# EAGLE design El_Würfel (EAGLE 7.7.0)
ABTEILUNG: Technische Informatik; BEARBEITER: Andrej Tica; DOKUMENTART: Schaltplan; GEZ: TicA; ID: 2AHEL; SCHALTPLAN: El_Wuerfel_V0; STATUS: Prototyp; VER: 1.0

## Sheet 1 of 2
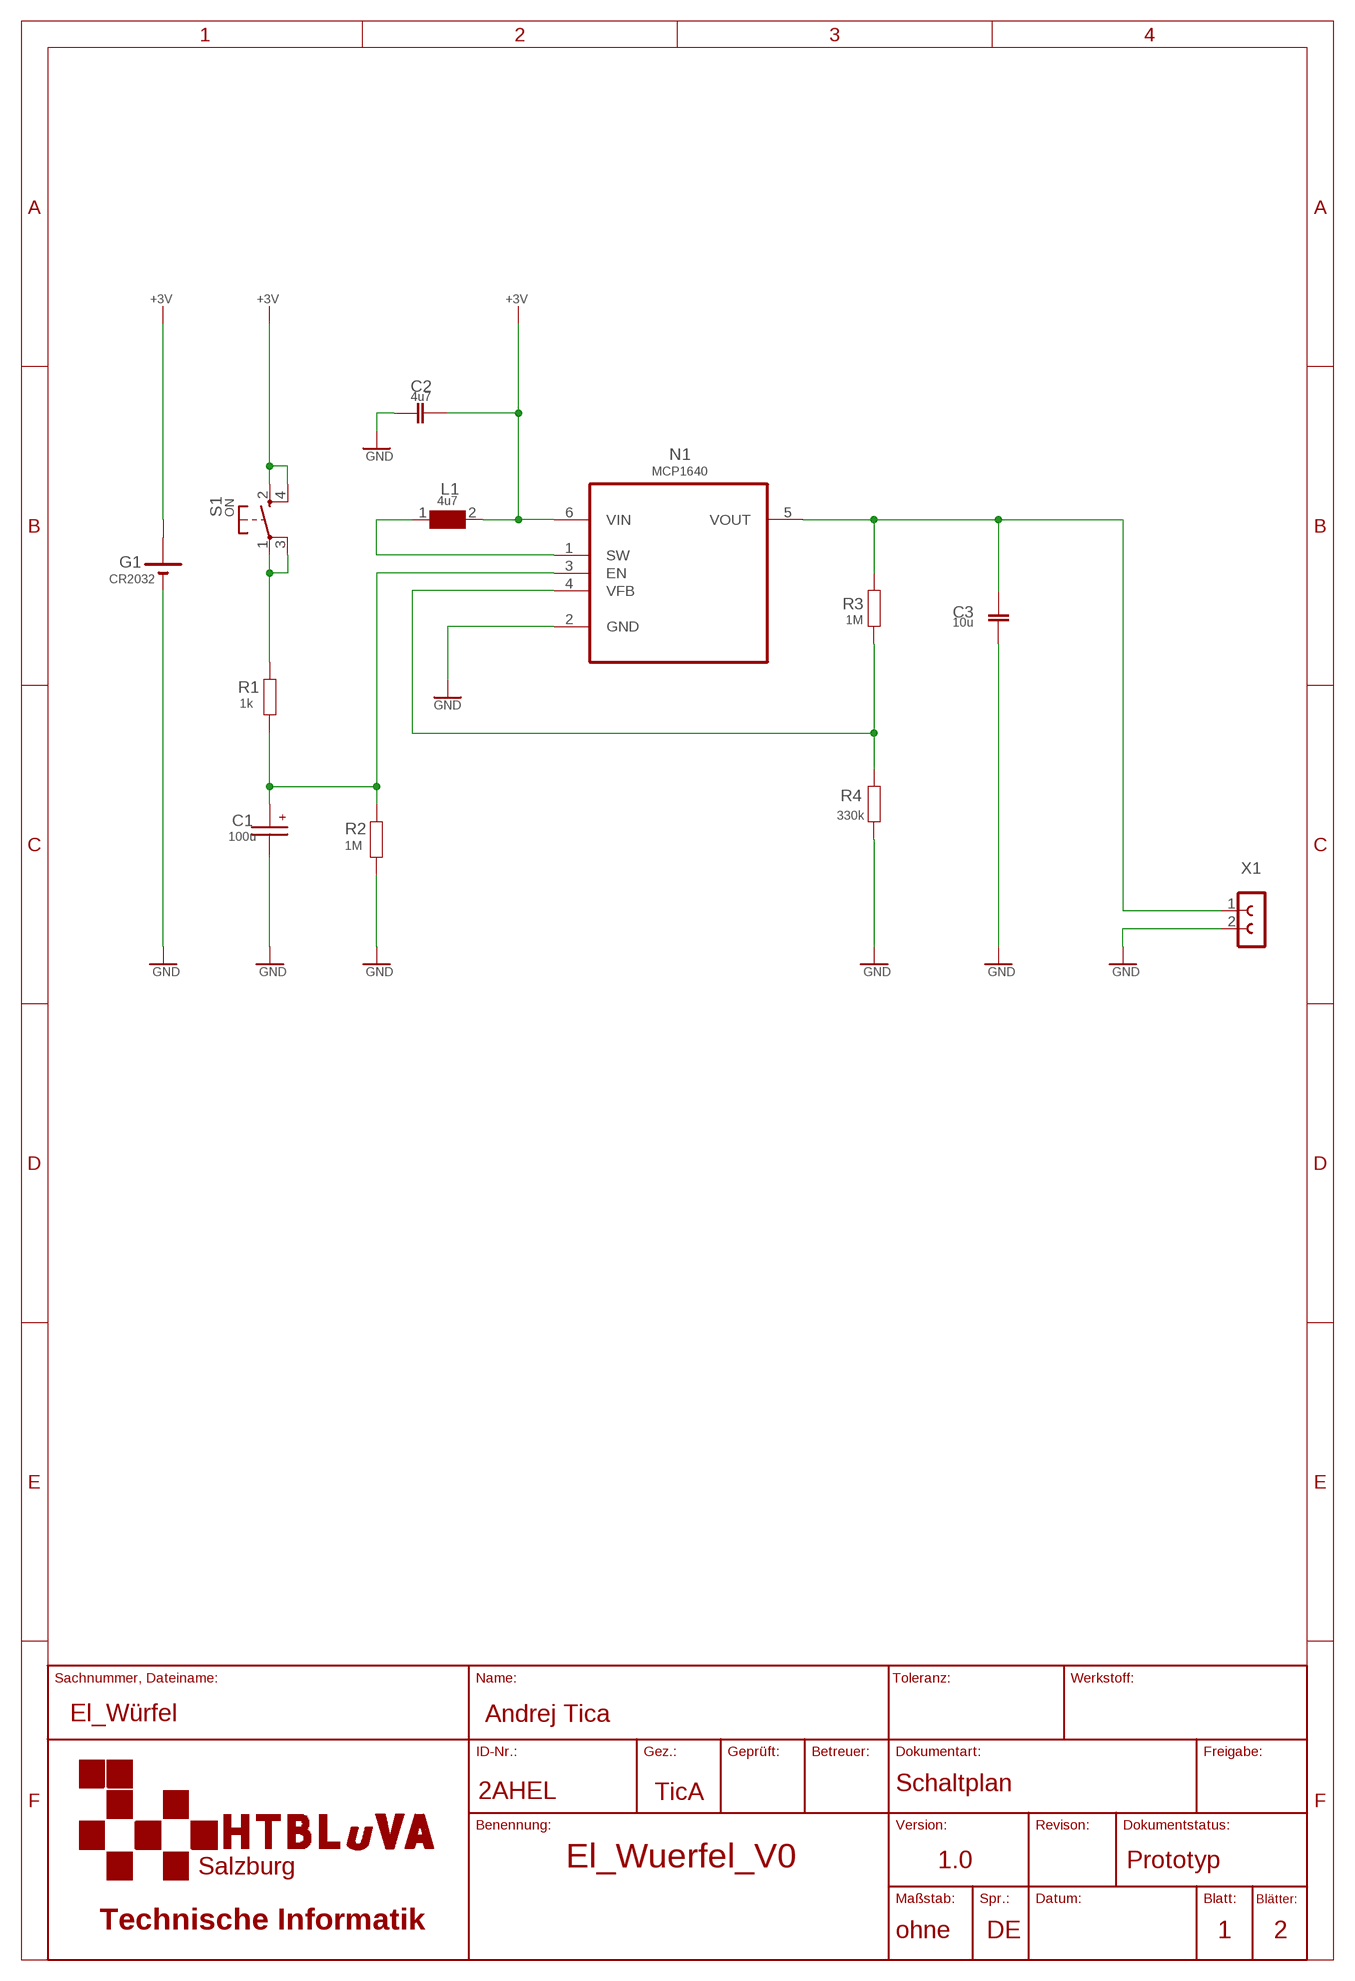
[diagram p0: schematic, sheet 1]

### Parts
C1  100u  CPOL-V_B/3528-21R  [B/3528-21R]
C2  4u7  C-EU1206  [MYLIB_C1206]
C3  10u  C-EU1206  [MYLIB_C1206]
G1  CR2032  KNOPFZELLE3V2CR  [MYLIB_CR2032]
L1  4u7  WE-PD2_4532  [WE-PD2_4532]
N1  MCP1640  MCP1640BT-I/CHY  [SOT95P270X145-6N]
R1  1k  RCL_R-EU_R1206  [MYRCL_R1206]
R2  1M  RCL_R-EU_R1206  [MYRCL_R1206]
R3  1M  RCL_R-EU_R1206  [MYRCL_R1206]
R4  330k  RCL_R-EU_R1206  [MYRCL_R1206]
S1  ON  TASTE10-XXSMD_LW  [WE_436331045822]
X1  BU-LEISTE2  [1X02-SPF-WW]

### Nets
+3V: C2.- G1.+@1(+) L1.2 N1.6(VIN) S1.2(S) S1.4(S1)
GND: C1.- C2.+ C3.+ G1.- N1.2(GND) R2.1 R4.1 X1.2 ; also sheet 2
N$2: N1.4(VFB) R3.1 R4.2
N$3: L1.1 N1.1(SW)
N$4: C3.- N1.5(VOUT) R3.2 X1.1
N$6: R1.2 S1.1(P) S1.3(P1)
N$7: C1.+ N1.3(EN) R1.1 R2.2
Unconnected: G1.+@2(+)

## Sheet 2 of 2
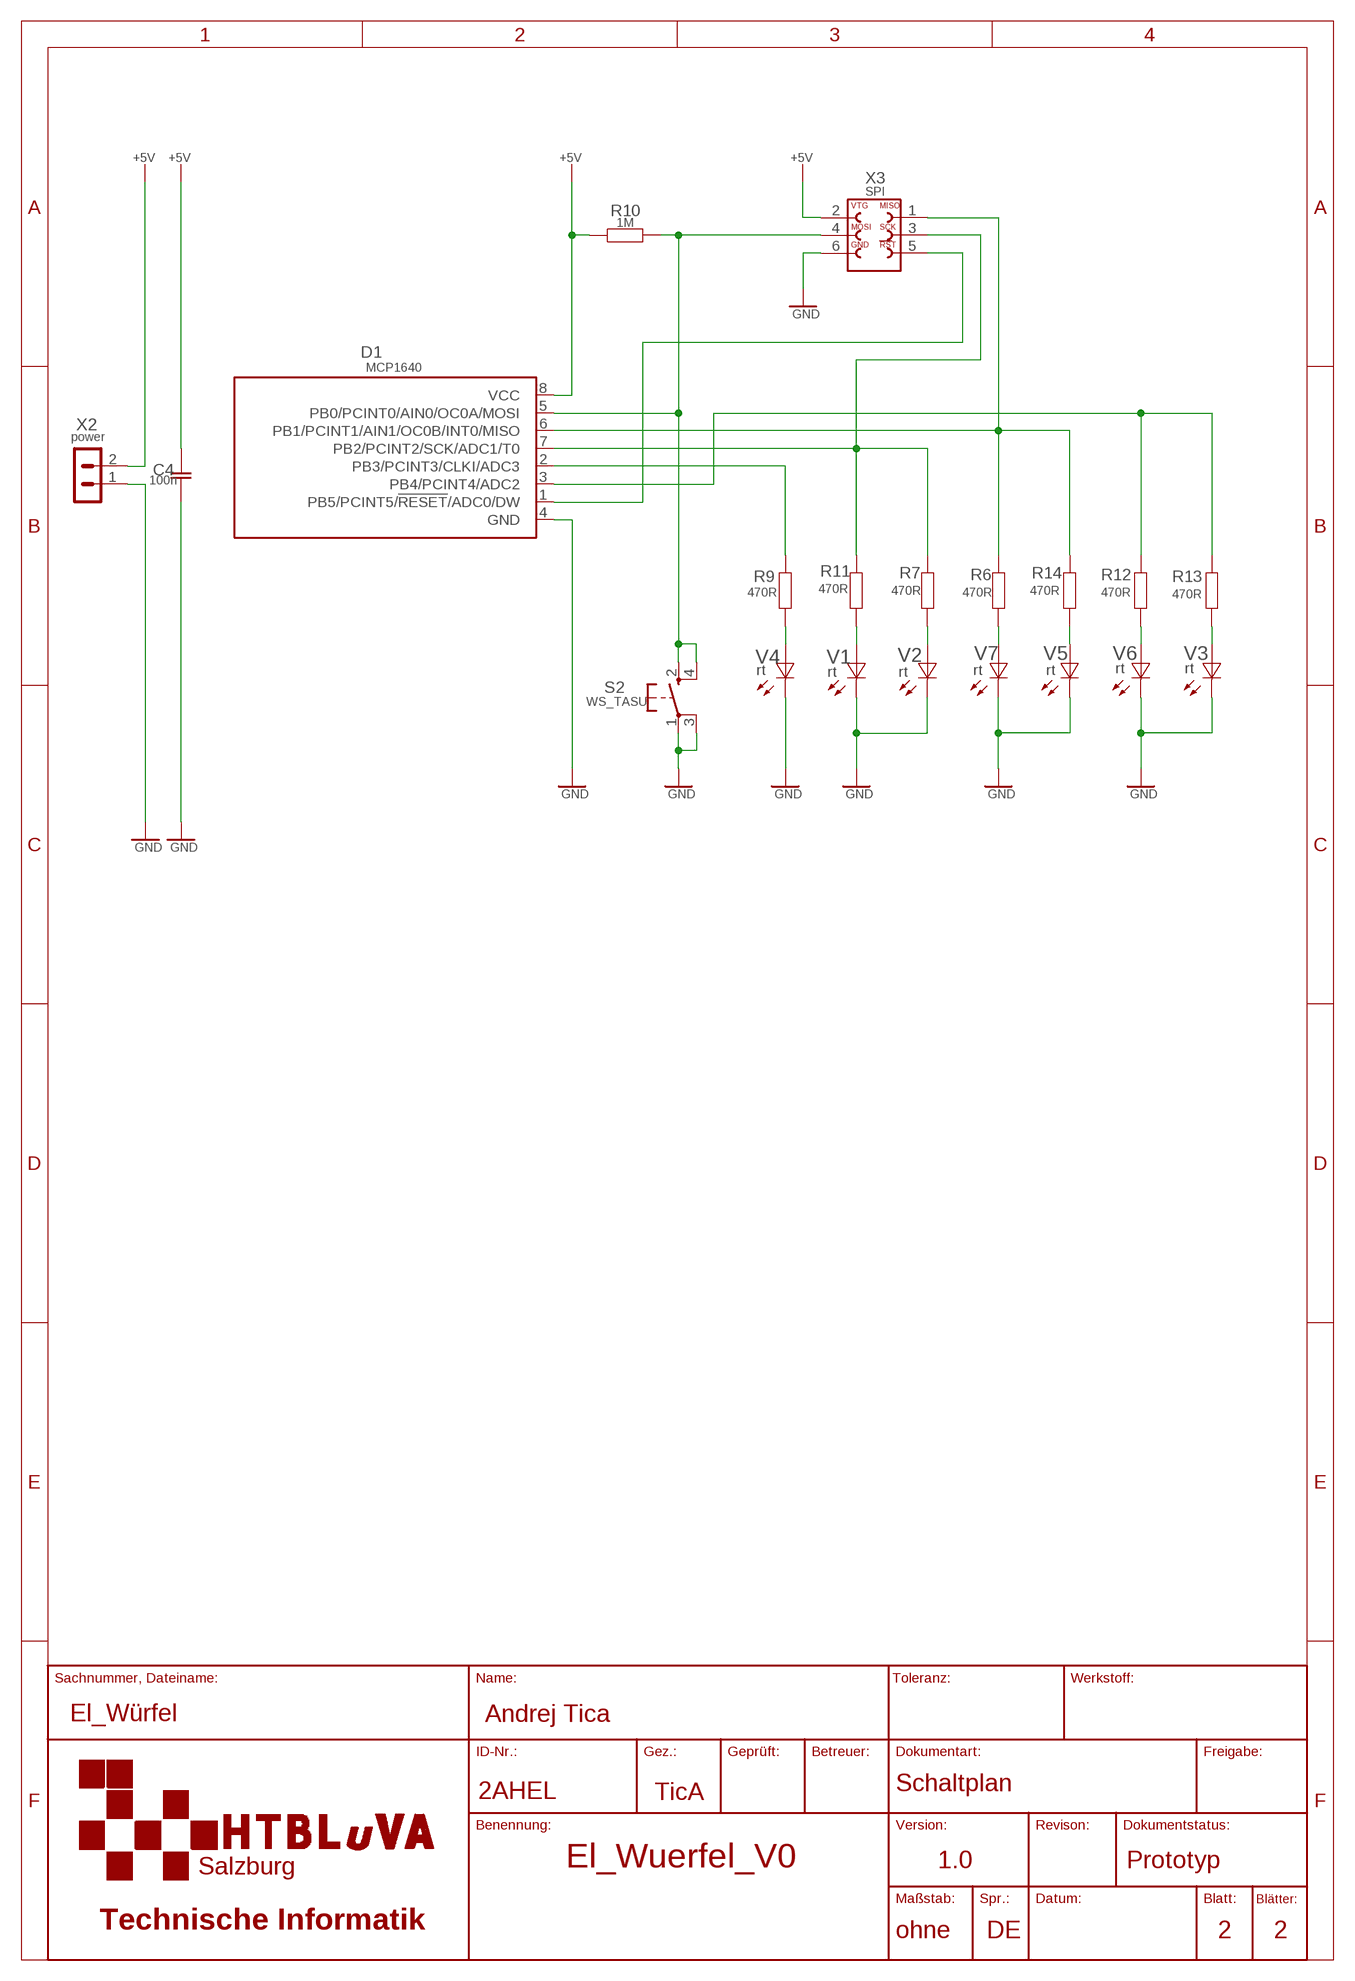
[diagram p1: schematic, sheet 2]

### Parts
C4  100n  C-EU1206  [MYLIB_C1206]
D1  MCP1640  TINY13SF  [8S2_W]
R6  470R  RCL_R-EU_M1206  [MYRCL_M1206]
R7  470R  RCL_R-EU_M1206  [MYRCL_M1206]
R9  470R  RCL_R-EU_M1206  [MYRCL_M1206]
R10  1M  RCL_R-EU_M1206  [MYRCL_M1206]
R11  470R  RCL_R-EU_M1206  [MYRCL_M1206]
R12  470R  RCL_R-EU_M1206  [MYRCL_M1206]
R13  470R  RCL_R-EU_M1206  [MYRCL_M1206]
R14  470R  RCL_R-EU_M1206  [MYRCL_M1206]
S2  WS_TASU  TASTE10-XXWE  [WE_436331045822]
V1  rt  DIODE_LEDCHIPLED_1206  [MYDIODE_CHIPLED_1206]
V2  rt  DIODE_LEDCHIPLED_1206  [MYDIODE_CHIPLED_1206]
V3  rt  DIODE_LEDCHIPLED_1206  [MYDIODE_CHIPLED_1206]
V4  rt  DIODE_LEDCHIPLED_1206  [MYDIODE_CHIPLED_1206]
V5  rt  DIODE_LEDCHIPLED_1206  [MYDIODE_CHIPLED_1206]
V6  rt  DIODE_LEDCHIPLED_1206  [MYDIODE_CHIPLED_1206]
V7  rt  DIODE_LEDCHIPLED_1206  [MYDIODE_CHIPLED_1206]
X2  power  M02  [02P]
X3  SPI  610006243021SMT_WR_MM_NEU  [690367280676_NEU]

### Nets
+5V: C4.- D1.8(VCC) R10.1 X2.2 X3.2
GND: C4.+ D1.4(GND) S2.1(P) S2.3(P1) V1.C V2.C V3.C V4.C V5.C V6.C V7.C X2.1 X3.6 ; also sheet 1
N$5: D1.1(PB5/PCINT5/!RESET!/ADC0/DW) X3.5
N$8: D1.3(PB4/PCINT4/ADC2) R12.2 R13.2
N$9: R13.1 V3.A
N$10: R11.1 V1.A
N$11: R12.1 V6.A
N$12: R6.1 V7.A
N$13: R14.1 V5.A
N$14: D1.6(PB1/PCINT1/AIN1/OC0B/INT0/MISO) R6.2 R14.2 X3.1
N$17: R9.1 V4.A
N$18: D1.2(PB3/PCINT3/CLKI/ADC3) R9.2
N$19: D1.7(PB2/PCINT2/SCK/ADC1/T0) R7.2 R11.2 X3.3
N$20: R7.1 V2.A
N$22: D1.5(PB0/PCINT0/AIN0/OC0A/MOSI) R10.2 S2.2(S) S2.4(S1) X3.4

## Library data of the parts
C1 = rcl_TicA:CPOL-V_: POLARIZED CAPACITOR, European symbol
C2 C3 = rcl_TicA:C-EU
C4 = 3D_Wuerfel_V1_1_R01:C-EU
D1 = 3D_Wuerfel_V1_1_R01:TINY13: 8-bit AVR Microcontroller with 1K Bytes In-System Programmable Flash Source: http://www.atmel.com/dyn/resources/prod_documents/2535S.pdf
G1 = 3D_Netzteil_V1_0_R03:KNOPFZELLE3V2: CR2032 Knopfzellenhalter für Printmontage und sonstige Anwendungen
L1 = 3D_Netzteil_V1_0_R03:WE-PD2: SMD-Power Inductors WE-PD2 - Industry standard size - Current capability up to 14 A -- Switching regulators with low operating voltages (computer, laptop, mobile phones, pagers) -- Integrated DC/DC-converter -- Is recommended for the application with switching regulators from National Semiconductor, Linear Technology, Texas Instruments and Fairchild Semiconductor -- Perfectly suitable for switching regulators with extremely high efficiency
N1 = ic-logik_TicA:MCP1640BT-I/CHY: Synchronous Boost Regulator; MPN: MCP1640BT-I/CHY; OC_FARNELL: 1800207; OC_NEWARK: 73R3625; PACKAGE: SOT-6; SUPPLIER: Microchip
R1-R4 = Netzteil_WenN2016:RCL_R-EU_: RESISTOR, European symbol
R6 R7 R9-R14 = 3D_Wuerfel_V1_1_R01:RCL_R-EU_: RESISTOR, European symbol
S1 = switch_TicA:TASTE10-XX: OMRON SWITCH
S2 = 3D_Wuerfel_V1_1_R01:TASTE10-XX: OMRON SWITCH
V1-V7 = 3D_Wuerfel_V1_1_R01:DIODE_LED: LED OSRAM: - CHIPLED LG R971, LG N971, LY N971, LG Q971, LY Q971, LO R971, LY R971 LH N974, LH R974 LS Q976, LO Q976, LY Q976 LO Q996 - Hyper CHIPLED LW Q18S LB Q993, LB Q99A, LB R99A - SideLED LS A670, LO A670, LY A670, LG A670, LP A670 LB A673, LV A673, LT A673, LW A673 LH A674 LY A675 LS A676, LA A676, LO A676, LY A676, LW A676 LS A679, LY A679, LG A679 - Hyper Micro SIDELED® LS Y876, LA Y876, LO Y876, LY Y876 LT Y87S - SmartLED LW L88C, LW L88S LB L89C, LB L89S, LG L890 LS L89K, LO L89K, LY L89K LS L896, LA L896, LO L896, LY L896 - TOPLED LS T670, LO T670, LY T670, LG T670, LP T670 LSG T670, LSP T670, LSY T670, LOP T670, LYG T670 LG T671, LOG T671, LSG T671 LB T673, LV T673, LT T673, LW T673 LH T674 LS T676, LA T676, LO T676, LY T676, LB T676, LH T676, LSB T676, LW T676 LB T67C, LV T67C, LT T67C, LS T67K, LO T67K, LY T67K, LW E67C LS E67B, LA E67B, LO E67B, LY E67B, LB E67C, LV E67C, LT E67C LW T67C LS T679, LY T679, LG T679 LS T770, LO T770, LY T770, LG T770, LP T770 LB T773, LV T773, LT T773, LW T773 LH T774 LS E675, LA E675, LY E675, LS T675 LS T776, LA T776, LO T776, LY T776, LB T776 LHGB T686 LT T68C, LB T68C - Hyper Mini TOPLED® LB M676 - Mini TOPLED Santana® LG M470 LS M47K, LO M47K, LY M47K Source: http://www.osram.convergy.de/
X1 = 3D_Netzteil_V1_0_R03:BU-LEISTE2: Buchsenleiste WW und Sonepar 12 15 62 50-pol
X2 = 3D_Wuerfel_V1_1_R01:M02: AMP QUICK CONNECTOR; OC_FARNELL: unknown; OC_NEWARK: unknown
X3 = 3D_Wuerfel_V1_1_R01:610006243021: WR-PHD 2.54mm SMT Dual Socket Header Bottom Entry, 6 Pins

## Board
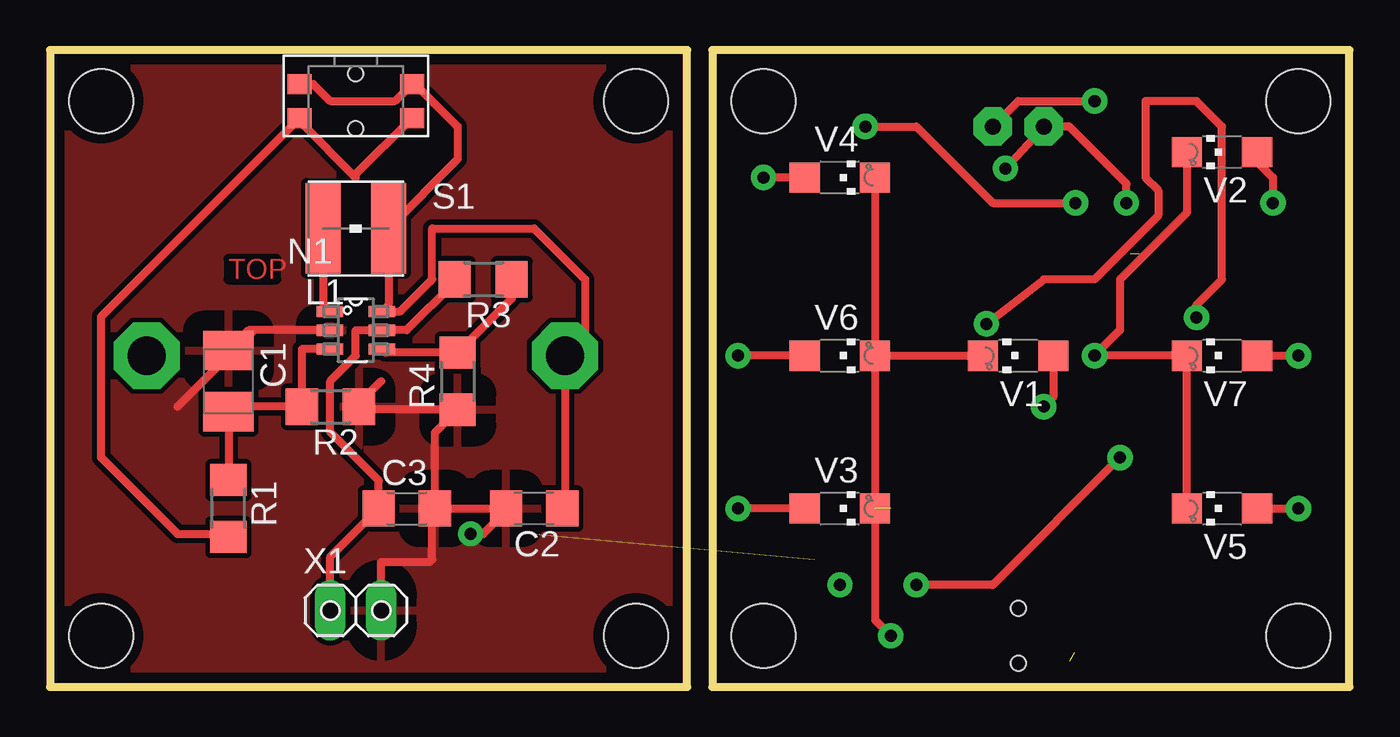
[diagram p2: board, top side]
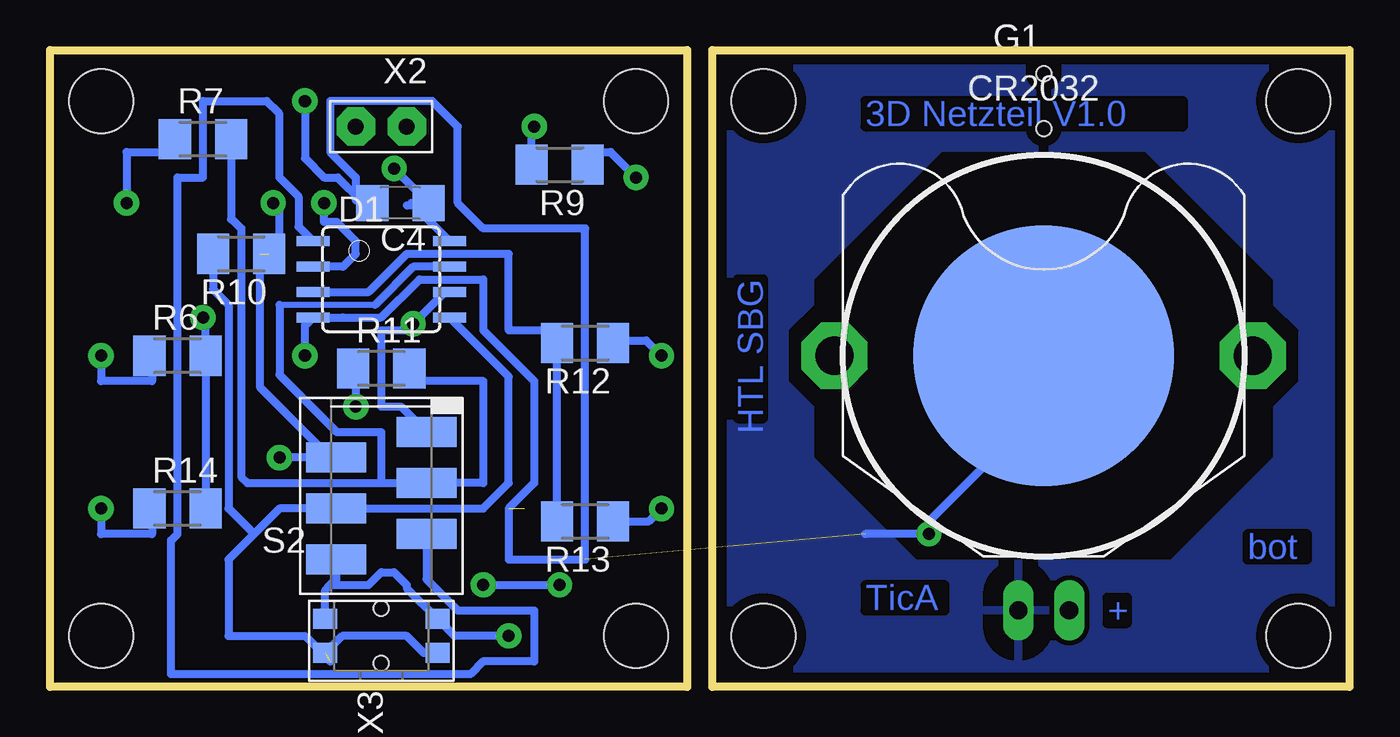
[diagram p3: board, bottom side, seen from below]

Size 64.77 x 31.75 mm. Coordinates in mm from the lower left corner, seen from the top.
Outline: 0,0 31.75,0 31.75,31.75 0,31.75 0,0
Outline: 33.02,0 64.77,0 64.77,31.75 33.02,31.75 33.02,0
Copper layers (1+16): Top 0.035559375mm / dielectric 1.501140625mm / Bottom 0.035559375mm
Design rules "2HN": minimum track width 16mil, minimum drill 0.599440625mm, track to track 10mil, track to pad 8mil, pad to pad 8mil, via to via 8mil, smd to smd 8mil, copper to edge 20mil, drill to drill 8mil, minimum pad ring 12mil, minimum via ring 13mil, stop-mask expansion 4mil, vias tented up to drill 0mil, thermal gap 40mil
Holes 3.2 mm at 2.54,29.21 29.21,29.21 29.21,2.54 2.54,2.54 35.56,29.21 62.23,29.21 62.23,2.54 35.56,2.54

### Footprints (pad centres in the part's own frame; a part is rotated, then mirrored left to right if it is on the bottom)
B/3528-21R = smd 1.95 x 2.5: + 1.525,0; - -1.525,0
MYLIB_C1206 = smd 1.6 x 1.8: + 1.4,0; - -1.4,0
8S2_W = smd 0.5 x 1.654: 1 -1.905,-3.404; 2 -0.645,-3.404; 3 0.625,-3.404; 4 1.895,-3.404; 5 1.905,3.404; 6 0.635,3.404; 7 -0.635,3.404; 8 -1.905,3.404
MYLIB_CR2032 = drill 1.9 pad 3.3 octagon: +@1 -10.425,0; +@2 10.425,0 | smd 13 x 13: - 0,0
WE-PD2_4532 = smd 1.75 x 4.5: 1 -1.625,0; 2 1.625,0
SOT95P270X145-6N = smd 1.321 x 0.559: 1 -1.295,0.94; 2 -1.295,0; 3 -1.295,-0.94; 4 1.295,-0.94; 5 1.295,0; 6 1.295,0.94
MYRCL_R1206 = smd 1.6 x 1.803: 1 -1.422,0; 2 1.422,0
MYRCL_M1206 = smd 1.6 x 2: 1 -1.4,0; 2 1.4,0
WE_436331045822 = smd 1.2 x 1: 1 2.8,0.85; 2 2.8,-0.85; 3 -2.8,0.85; 4 -2.8,-0.85 | hole 0.75: 0,1.375; 0,-1.375
MYDIODE_CHIPLED_1206 = smd 1.5 x 1.5: A 0,-1.75; C 0,1.75
1X02-SPF-WW = drill 0.9 long: 1 -1.27,0; 2 1.27,0
02P = drill 0.8 pad 1.93 octagon: 1 -1.27,0; 2 1.27,0
690367280676_NEU = smd 1.5 x 3: 1 2.54,-2.25; 2 1.27,2.25; 3 0,-2.25; 4 -1.27,2.25; 5 -2.54,-2.25; 6 -3.81,2.25

### Placement (x,y rotation side)
C1  8.89,15.24 270 top
C2  24.13,8.89 180 top
C3  17.78,8.89 0 top
C4  47.31,24.13 180 bottom
D1  48.26,20.32 270 bottom
G1  15.24,16.51 0 bottom
L1  15.24,22.86 0 top
N1  15.24,17.78 0 top
R1  8.89,8.89 270 top
R2  13.97,13.97 180 top
R3  21.59,20.32 180 top
R4  20.32,15.24 90 top
R6  58.42,16.51 0 bottom
R7  57.15,27.3 0 bottom
R9  39.37,26.04 180 bottom
R10  55.24,21.59 180 bottom
R11  48.26,15.88 0 bottom
R12  38.1,17.14 180 bottom
R13  38.1,8.26 180 bottom
R14  58.42,8.89 0 bottom
S1  15.24,29.21 180 top
S2  48.26,2.54 0 bottom
V1  48.26,16.51 90 top
V2  58.42,26.67 90 top
V3  39.37,8.89 270 top
V4  39.37,25.4 270 top
V5  58.42,8.89 90 top
V6  39.37,16.51 270 top
V7  58.42,16.51 90 top
X1  15.24,3.81 0 top
X2  48.26,27.94 180 bottom
X3  48.26,10.16 90 bottom

### Tracks (layer width: path | path; a pad name or v marks a point on that pad's centre or on a via)
+3V
  Top 0.406: C2.- 25.66,9.03 G1.+@1 26.67,17.52 26.67,20.32 24.13,22.86 19.05,22.86 19.05,20.32 17.45,18.72 N1.6 16.86,19.05 L1.2 20.32,26.32 20.32,27.94 18.2,30.06 S1.4 17.19,29.21 13.97,29.21 13.12,30.06 S1.2
+5V  (via drill 0.6)  (1 unrouted)
  Top 0.406: v47.62,25.85 X2.2 50.8,27.94 53.66,25.08 v53.66,24.13 | v43.18,5.08 46.99,5.08 v53.34,11.43
  Bottom 0.406: v47.62,25.85 C4.- | C4.- 46.76,24.13 D1.8 | 46.99,24 C4.- | 50.8,11.43 54.29,14.92 54.29,21.59 | v43.18,5.08 v39.37,5.08 | 50.8,11.43 v53.34,11.43 | 50.8,11.43 X3.2 | R10.1 53.34,21.59 53.34,23.81 v53.66,24.13
GND  (via drill 0.6)  (2 unrouted)
  Top 0.406: X1.2 16.51,6.22 18.92,6.22 19.05,6.35 19.05,8.76 C3.+ | C3.+ C2.+ 22.73,8.76 21.59,7.62 v20.95,7.62 | C3.+ 19.18,12.68 R4.1 15.54,13.82 R2.1 | 10.16,17.78 9.9,17.78 C1.- | R2.1 15.39,13.82 | R2.1 15.39,14.12 16.51,15.24 | V6.C V3.C 41.12,3.33 v41.91,2.54 | V5.C V7.C v52.07,16.51 53.34,17.78 53.34,20.32 56.67,23.65 V2.C | V4.C V6.C | V6.C V1.C | v52.07,29.21 48.26,29.21 X2.1 | N1.2 10.16,17.78 | 10.16,17.78 6.35,13.97
  Bottom 0.406: G1.- 15.24,13.97 20.95,8.26 v20.95,7.62 24.13,7.62 | v41.91,2.54 44.61,2.54 S2.1 46.99,4.92 46.99,5.08 47.62,5.71 48.26,5.71 48.9,5.08 50.8,5.08 | S2.3 51.06,4.82 50.8,5.08 | v52.07,29.21 52.07,26.35 51.12,25.4 50.43,25.4 49.25,24.22 | X3.6 50.51,5.37 50.8,5.08 | v52.07,16.51 52.07,18.02 D1.4 50.17,18.43 48.26,18.41 46.35,20.32 43.18,20.32 43.18,17.78 40.64,15.24 40.64,10.16 41.91,8.89 41.91,6.35 38.1,6.35 38.1,22.86 43.18,22.86 44.45,24.13 44.45,27.94 45.72,29.21 50.8,29.21 50.8,26.67 49.53,25.4 49.53,24.26 49.25,24.22 | 49.25,24.22 C4.+
  pour Top: 0,31.75 0,0 31.75,0 31.75,31.75
  pour Bottom: 0,31.75 0,0 31.75,0 31.75,31.75
N$2
  Top 0.406: R3.1 23.01,19.35 R4.2 16.71,16.66 N1.4
N$3
  Top 0.406: L1.1 13.62,19.05 N1.1
N$4
  Top 0.406: R3.2 20.17,20.17 17.78,17.78 N1.5 15.24,17.78 15.24,16.51 13.97,15.24 13.97,12.7 16.38,10.29 C3.- 13.97,6.48 X1.1
N$5
  Bottom 0.406: X3.5 46.01,5.37 44.45,3.81 40.64,3.81 40.64,1.27 43.18,1.27 43.81,0.64 58.74,0.64 58.74,7.3 58.42,7.62 58.42,25.4 57.15,25.4 57.15,29.21 53.98,29.21 53.34,28.57 53.34,25.4 52.39,24.45 52.39,22.95 D1.1 51.75,22.31
N$6
  Top 0.406: 8.89,7.62 R1.2 8.74,7.62 6.35,7.62 2.54,11.43 2.54,18.46 S1.1 12.44,28.2 15.24,25.4 15.24,25.56 S1.3
N$7
  Top 0.406: N1.3 12.55,16.84 R2.2 8.89,13.97 C1.+ R1.1
N$8
  Bottom 0.406: R13.2 R12.2 40.13,17.78 41.91,17.78 41.91,21.59 46.99,21.59 48.88,19.7 D1.3
N$9  (via drill 0.6)
  Top 0.406: v34.29,8.89 V3.A 38.1,8.89
  Bottom 0.406: R13.1 34.92,8.26 v34.29,8.89
N$10  (via drill 0.6)
  Top 0.406: 49.53,16.51 V1.A 50.01,14.45 v49.53,13.97
  Bottom 0.406: R11.1 49.53,15.24 v49.53,13.97
N$11  (via drill 0.6)
  Top 0.406: v34.29,16.51 V6.A 38.1,16.51
  Bottom 0.406: R12.1 36.83,17.27 35.05,17.27 v34.29,16.51
N$12  (via drill 0.6)
  Top 0.406: v62.23,16.51 V7.A 59.69,16.51
  Bottom 0.406: R6.1 59.69,16.51 59.69,15.24 62.23,15.24 v62.23,16.51
N$13  (via drill 0.6)
  Top 0.406: v62.23,8.89 V5.A 59.69,8.89
  Bottom 0.406: R14.1 59.69,8.89 59.69,7.62 62.23,7.62 v62.23,8.89
N$14  (via drill 0.6)
  Top 0.406: v57.15,18.41 57.15,19.05 58.42,20.32 58.42,27.94 57.15,29.21 54.61,29.21 54.61,25.4 55.24,24.77 55.24,23.5 52.07,20.32 49.53,20.32 v46.67,18.1
  Bottom 0.406: R14.2 R6.2 57.02,18.29 v57.15,18.41 | X3.1 47.28,13.97 48.26,13.97 48.26,17.78 46.99,17.78 v46.67,18.1 45.09,19.68 D1.6
N$15
  cutout Bottom (isolate 0.406): 2.54,15.24 3.81,13.97 3.81,11.43 8.89,6.35 21.59,6.35 26.67,11.43 26.67,13.97 27.94,15.24 27.94,17.78 26.67,19.05 26.67,20.32 20.32,26.67 10.16,26.67 3.81,20.32 3.81,19.05 2.54,17.78
N$17  (via drill 0.6)
  Top 0.406: v35.56,25.4 V4.A 38.1,25.4
  Bottom 0.406: R9.1 38.1,26.67 36.83,26.67 v35.56,25.4
N$18  (via drill 0.6)
  Top 0.406: v40.64,27.94 43.18,27.94 46.99,24.13 v51.12,24.13
  Bottom 0.406: R9.2 40.77,27.81 v40.64,27.94 | v51.12,24.13 51.12,23.18 50.48,23.18 49.53,22.23 49.53,21.59 50.16,20.95 D1.2
N$19
  Bottom 0.305: 48.58,19.05 53.34,19.05
  Bottom 0.406: 48.26,10.16 54.93,10.16 55.24,10.48 55.24,22.86 55.69,23.31 55.75,23.31 R7.2 | 48.26,10.16 X3.3 43.18,10.16 43.18,15.24 46.23,15.24 R11.2 | D1.7 46.67,20.95 48.58,19.05 | 53.34,19.05 53.34,15.56 50.48,12.7 48.26,12.7 48.26,10.16
N$20  (via drill 0.6)
  Top 0.406: v60.96,24.13 60.96,25.4 59.69,26.67 V2.A
  Bottom 0.406: v60.96,24.13 60.96,26.67 59.19,26.67 R7.1
N$22  (1 unrouted)
  Bottom 0.406: S2.2 46.14,1.69 46.99,2.54 50.21,2.54 S2.4 | 54.61,7.62 53.34,8.89 X3.4 43.18,8.89 41.91,10.16 41.91,15.47 D1.5 | 54.61,7.62 55.88,6.35 55.88,2.54 52.07,2.54 50.8,1.27 | 54.61,7.62 55.88,8.89 55.88,19.05 56.65,19.82 R10.2

### Text on the board
Top: TOP
Bottom: 3D Netzteil V1.0 | HTL SBG | bot | TicA | +